# Altium schematic sheet theremin.SchDoc
size A2
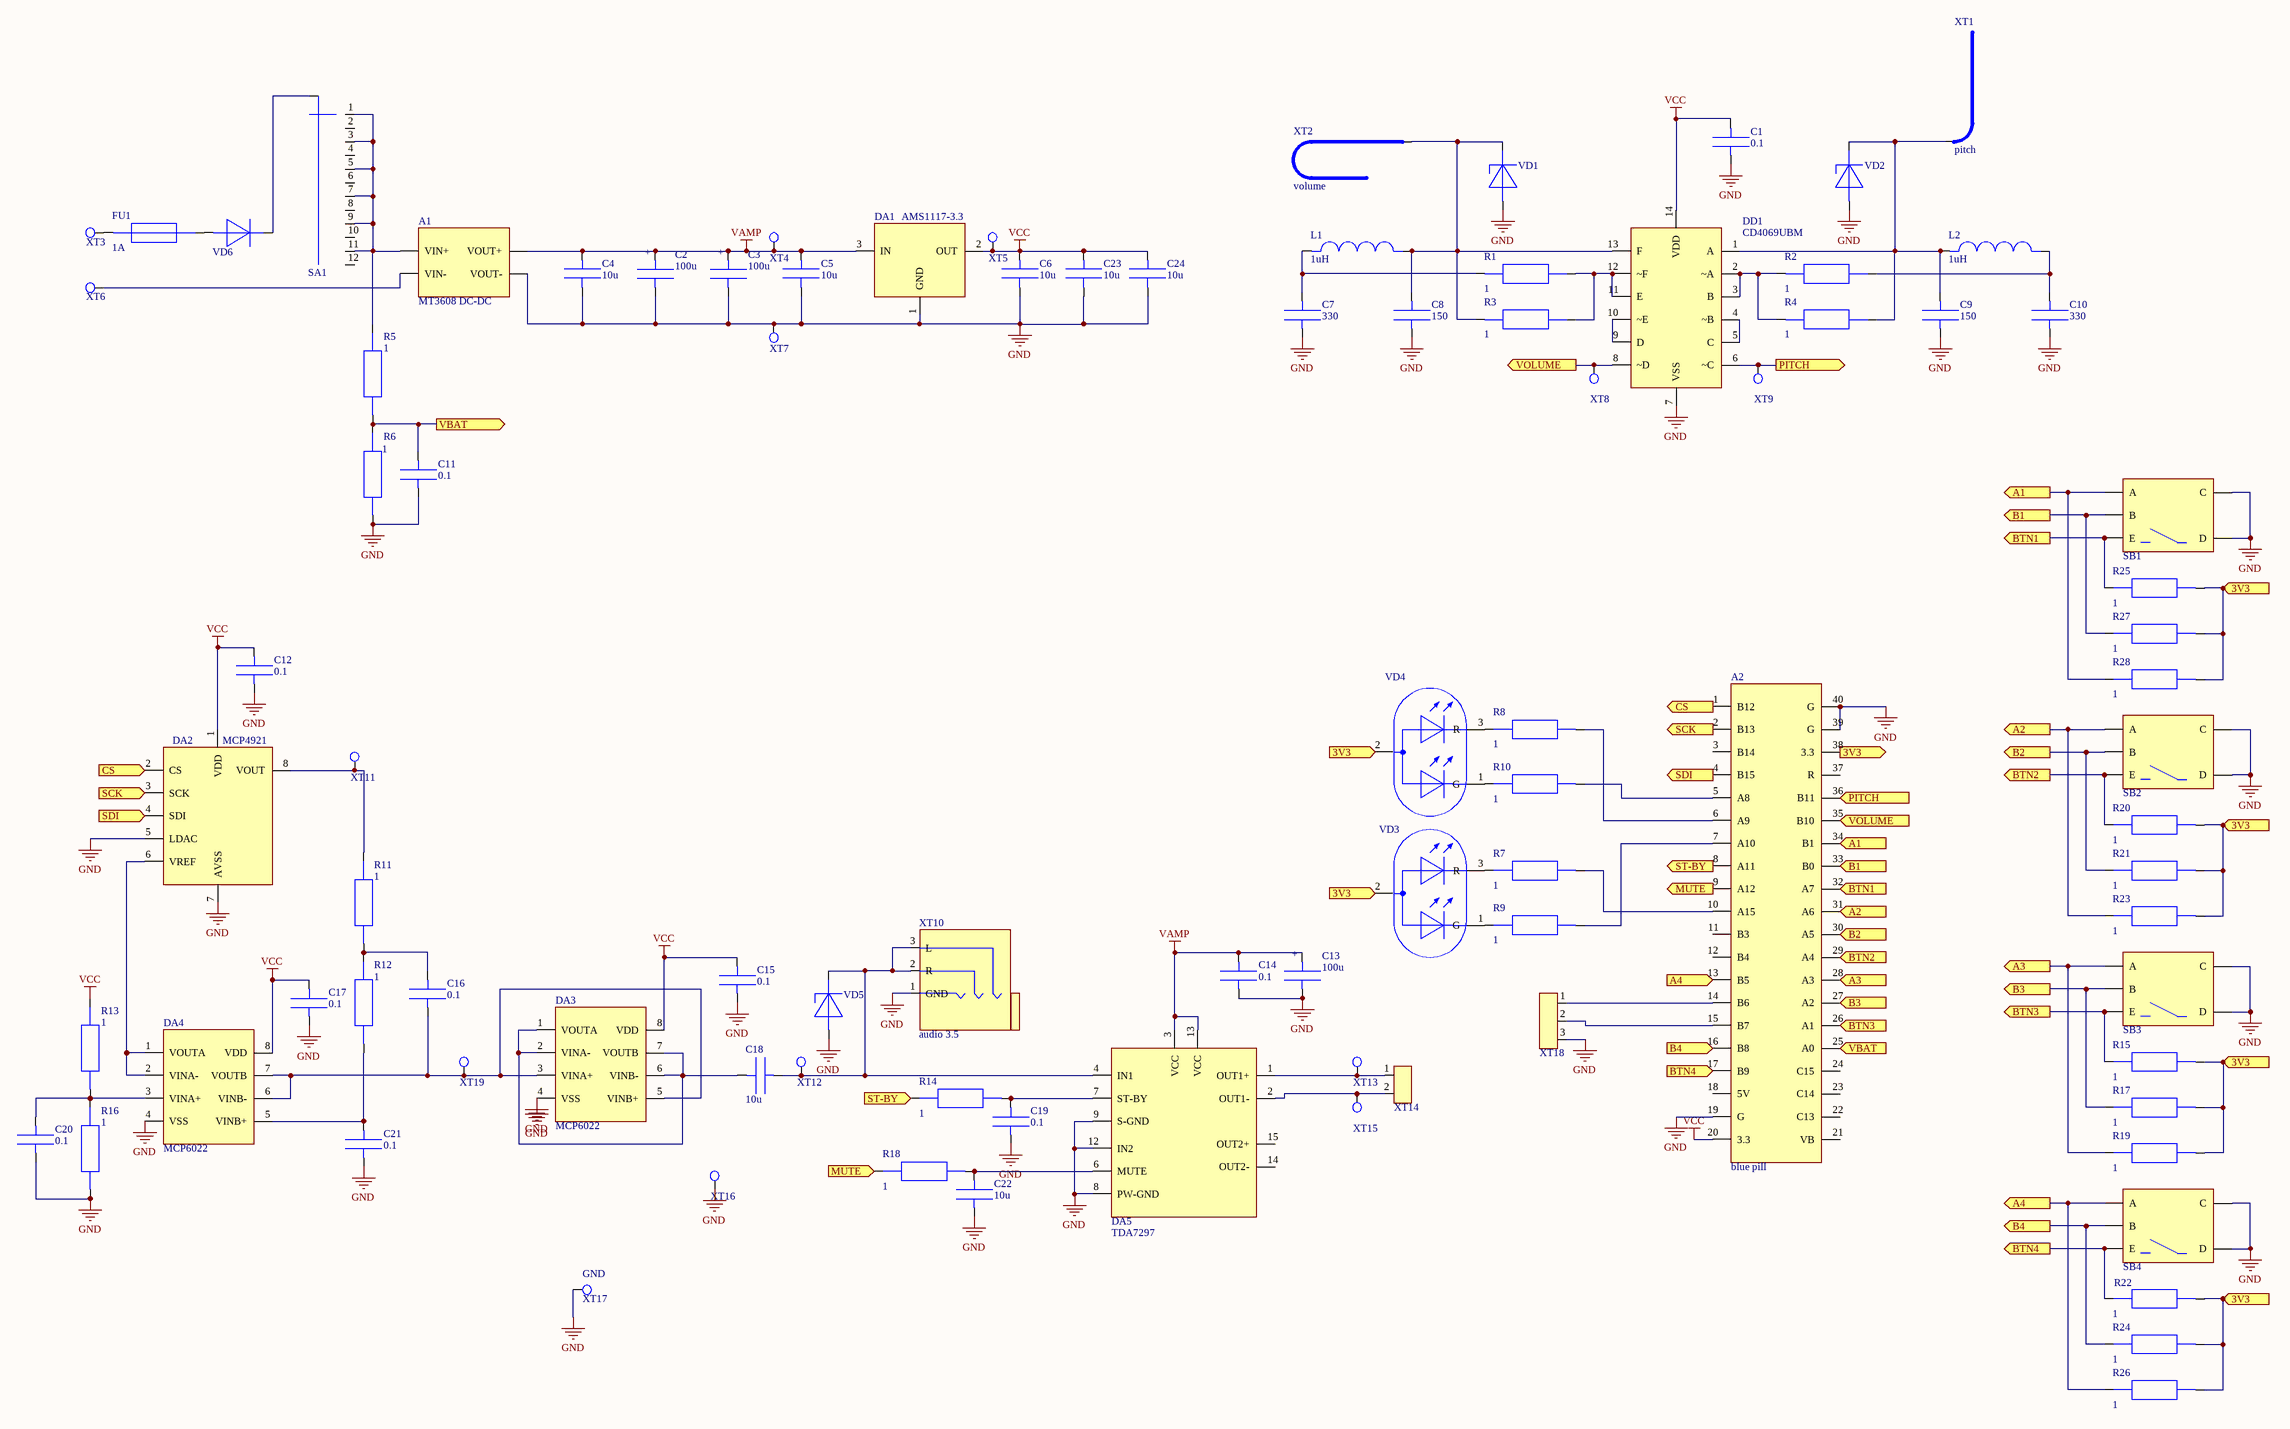
[diagram p0: theremin.SchDoc]

## Parts
A1  MT3608 DC-DC  [MT3608]
A2  blue pill  [blue pill]
C1  0.1  [C0805]
C2  100u  [C8x12]
C3  100u  [C8x12]
C4  10u  [C1206]
C5  10u  [C1206]
C6  10u  [C1206]
C7  330  [C0805]
C8  150  [C0805]
C9  150  [C0805]
C10  330  [C0805]
C11  0.1  [C0805]
C12  0.1  [C0805]
C13  100u  [C8x12]
C14  0.1  [C0805]
C15  0.1  [C0805]
C16  0.1  [C0805]
C17  0.1  [C0805]
C18  10u  [C1206]
C19  0.1  [C0805]
C20  0.1  [C0805]
C21  0.1  [C0805]
C22  10u  [C1206]
C23  10u  [C1206]
C24  10u  [C1206]
DA1  AMS1117-3.3  [SOT223]
DA2  MCP4921  [SO-8]
DA3  MCP6022  [SO-8]
DA4  MCP6022  [SO-8]
DA5  TDA7297  [TDA7297]
DD1  CD4069UBM  [CD4069UBM]
FU1  1A  [VP4]
L1  1uH  [L1812]
L2  1uH  [L1812]
R1  1  [R0805]
R2  1  [R0805]
R3  1  [R0805]
R4  1  [R0805]
R5  1  [R0805]
R6  1  [R0805]
R7  1  [R0805]
R8  1  [R0805]
R9  1  [R0805]
R10  1  [R0805]
R11  1  [R0805]
R12  1  [R0805]
R13  1  [R0805]
R14  1  [R0805]
R15  1  [R0805]
R16  1  [R0805]
R17  1  [R0805]
R18  1  [R0805]
R19  1  [R0805]
R20  1  [R0805]
R21  1  [R0805]
R22  1  [R0805]
R23  1  [R0805]
R24  1  [R0805]
R25  1  [R0805]
R26  1  [R0805]
R27  1  [R0805]
R28  1  [R0805]
SA1  Rotary switch  [rotary switch]  (value not drawn)
SB1  encoder  [EC11]  (value not drawn)
SB2  encoder  [EC11]  (value not drawn)
SB3  encoder  [EC11]  (value not drawn)
SB4  encoder  [EC11]  (value not drawn)
VD1  zener  [SOD523]  (value not drawn)
VD2  zener  [SOD523]  (value not drawn)
VD3  LED RG 3mm  [LED RG 3mm]  (value not drawn)
VD4  LED RG 3mm  [LED RG 3mm]  (value not drawn)
VD5  zener  [SOD523]  (value not drawn)
VD6  VD_SMB  [SMB]  (value not drawn)
XT1  pitch  [special_contact]
XT2  volume  [special_contact]
XT3  contact  [contact]  (value not drawn)
XT4  contact  [contact]  (value not drawn)
XT5  contact  [contact]  (value not drawn)
XT6  contact  [contact]  (value not drawn)
XT7  contact  [contact]  (value not drawn)
XT8  contact  [contact]  (value not drawn)
XT9  contact  [contact]  (value not drawn)
XT10  audio 3.5  [ST-214N]
XT11  contact  [contact]  (value not drawn)
XT12  contact  [contact]  (value not drawn)
XT13  contact  [contact]  (value not drawn)
XT14  connector  [B2P]  (value not drawn)
XT15  contact  [contact]  (value not drawn)
XT16  contact  [contact]  (value not drawn)
XT17  gnd_contact  [special_contact]  (value not drawn)
XT18  PLS-3  (value not drawn)
XT19  contact  [contact]  (value not drawn)

## Ports
3V3, A1, A2, A3, A4, B1, B2, B3, B4, BTN1, BTN2, BTN3, BTN4, CS, MUTE, PITCH, SCK, SDI, ST-BY, VBAT, VOLUME

## Nets
GND: A1.4(VOUT-) A2.19(G) A2.39(G) A2.40(G) C1.1 C2.1 C3.1 C4.1 C5.1 C6.1 C7.1 C8.1 C9.1 C10.1 C11.1 C12.1 C13.1 C14.1 C15.1 C17.1 C19.1 C20.1 C21.1 C22.2 C23.1 C24.1 DA1.1(GND) DA2.5(LDAC) DA2.7(AVSS) DA3.4(VSS) DA4.4(VSS) DA5.8(PW-GND) DA5.9(S-GND) DA5.12(IN2) DD1.7(VSS) R6.1 R16.1 SB1.C SB1.D SB2.C SB2.D SB3.C SB3.D SB4.C SB4.D VD1.1 VD2.1 VD5.1 XT7.1 XT10.1(GND) XT16.1 XT17.1 XT18.3
VAMP: A1.3(VOUT+) C2.2 C3.2 C4.2 C5.2 C13.2 C14.2 DA1.3(IN) DA5.3(VCC) DA5.13(VCC) XT4.1
VCC: A2.20(3.3) C1.2 C6.2 C12.2 C15.2 C17.2 C23.2 C24.2 DA1.2(OUT) DA2.1(VDD) DA3.8(VDD) DA4.8(VDD) DD1.14(VDD) R13.2 XT5.1
3V3: A2.38(3.3) R15.1 R17.1 R19.1 R20.1 R21.1 R22.1 R23.1 R24.1 R25.1 R26.1 R27.1 R28.1 VD3.2 VD4.2 ; port 3V3
A1: A2.34(B1) R28.2 SB1.A ; port A1
A2: A2.31(A6) R23.2 SB2.A ; port A2
A3: A2.28(A3) R19.2 SB3.A ; port A3
A4: A2.13(B5) R26.2 SB4.A ; port A4
B1: A2.33(B0) R27.2 SB1.B ; port B1
B2: A2.30(A5) R21.2 SB2.B ; port B2
B3: A2.27(A2) R17.2 SB3.B ; port B3
B4: A2.16(B8) R24.2 SB4.B ; port B4
BTN1: A2.32(A7) R25.2 SB1.E ; port BTN1
BTN2: A2.29(A4) R20.2 SB2.E ; port BTN2
BTN3: A2.26(A1) R15.2 SB3.E ; port BTN3
BTN4: A2.17(B9) R22.2 SB4.E ; port BTN4
CS: A2.1(B12) DA2.2(CS) ; port CS
MUTE: A2.9(A12) R18.2 ; port MUTE
PITCH: A2.36(B11) DD1.6(~C) XT9.1 ; port PITCH
SCK: A2.2(B13) DA2.3(SCK) ; port SCK
SDI: A2.4(B15) DA2.4(SDI) ; port SDI
ST-BY: A2.8(A11) R14.2 ; port ST-BY
VBAT: A2.25(A0) C11.2 R5.1 R6.2 ; port VBAT
VOLUME: A2.35(B10) DD1.8(~D) XT8.1 ; port VOLUME
NetA1_1: A1.1(VIN+) R5.2 SA1.1 SA1.3 SA1.5 SA1.7 SA1.9 SA1.11
NetA1_2: A1.2(VIN-) XT6.1
NetA2_5: A2.5(A8) R10.1
NetA2_6: A2.6(A9) R8.1
NetA2_7: A2.7(A10) R9.1
NetA2_10: A2.10(A15) R7.1
NetA2_14: A2.14(B6) XT18.1
NetA2_15: A2.15(B7) XT18.2
NetC7_2: C7.2 L1.1 R1.1
NetC8_2: C8.2 DD1.13(F) L1.2 R3.1 VD1.2 XT2.1
NetC9_2: C9.2 DD1.1(A) L2.1 R4.2 VD2.2 XT1.1
NetC10_2: C10.2 L2.2 R2.2
NetC16_1: C16.1 DA3.3(VINA+) DA3.5(VINB+) DA4.6(VINB-) DA4.7(VOUTB) XT19.1
NetC16_2: C16.2 R11.1 R12.2
NetC18_1: C18.1 DA5.4(IN1) VD5.2 XT10.2(R) XT10.3(L) XT12.1
NetC18_2: C18.2 DA3.1(VOUTA) DA3.2(VINA-) DA3.6(VINB-) DA3.7(VOUTB)
NetC19_2: C19.2 DA5.7(ST-BY) R14.1
NetC20_2: C20.2 DA4.3(VINA+) R13.1 R16.2
NetC21_2: C21.2 DA4.5(VINB+) R12.1
NetC22_1: C22.1 DA5.6(MUTE) R18.1
NetDA2_6: DA2.6(VREF) DA4.1(VOUTA) DA4.2(VINA-)
NetDA2_8: DA2.8(VOUT) R11.2 XT11.1
NetDA5_1: DA5.1(OUT1+) XT13.1 XT14.1
NetDA5_2: DA5.2(OUT1-) XT14.2 XT15.1
NetDD1_2: DD1.2(~A) DD1.3(B) R2.1 R4.1
NetDD1_4: DD1.4(~B) DD1.5(C)
NetDD1_9: DD1.9(D) DD1.10(~E)
NetDD1_11: DD1.11(E) DD1.12(~F) R1.2 R3.2
NetFU1_1: FU1.1 XT3.1
NetFU1_2: FU1.2 VD6.1
NetR7_2: R7.2 VD3.3(R)
NetR8_2: R8.2 VD4.3(R)
NetR9_2: R9.2 VD3.1(G)
NetR10_2: R10.2 VD4.1(G)
NetSA1_0: SA1.0 VD6.2

Not connected (* = marked no-connect by the designer): A2 3(B14) 11(B3) 12(B4) 18(5V) 21(VB) 22(C13) 23(C14) 24(C15) 37(R); DA5 14(OUT2-) 15(OUT2+); SA1 2 4 6 8 10 12

## Notes on the sheet
- Labels drawn without touching a wire or pin: GND
- (in symbol C8x12) +
- (in symbol gnd_contact) GND

## Library data of the parts
C1 C7-C12 C14-C17 C19-C21 = C0805
C2 C3 C13 = C8x12
C4-C6 C18 C22-C24 = C1210
FU1 = FU
L1 L2 = L1812
R1-R28 = R0805
XT10 = audiojack
XT17 = gnd_contact: source gnd connect